# Altium schematic sheet FPGA_52_Ethernet_Send_Frame_E_MAC_W.SchDoc
size B; Organization: Altium Limited; Address1: L3, 12a Rodborough Rd; Address2: Frenchs Forest; Address3: NSW; Address4: Australia 2086; DocumentNumber: 1; SheetNumber: 1; SheetTotal: 1
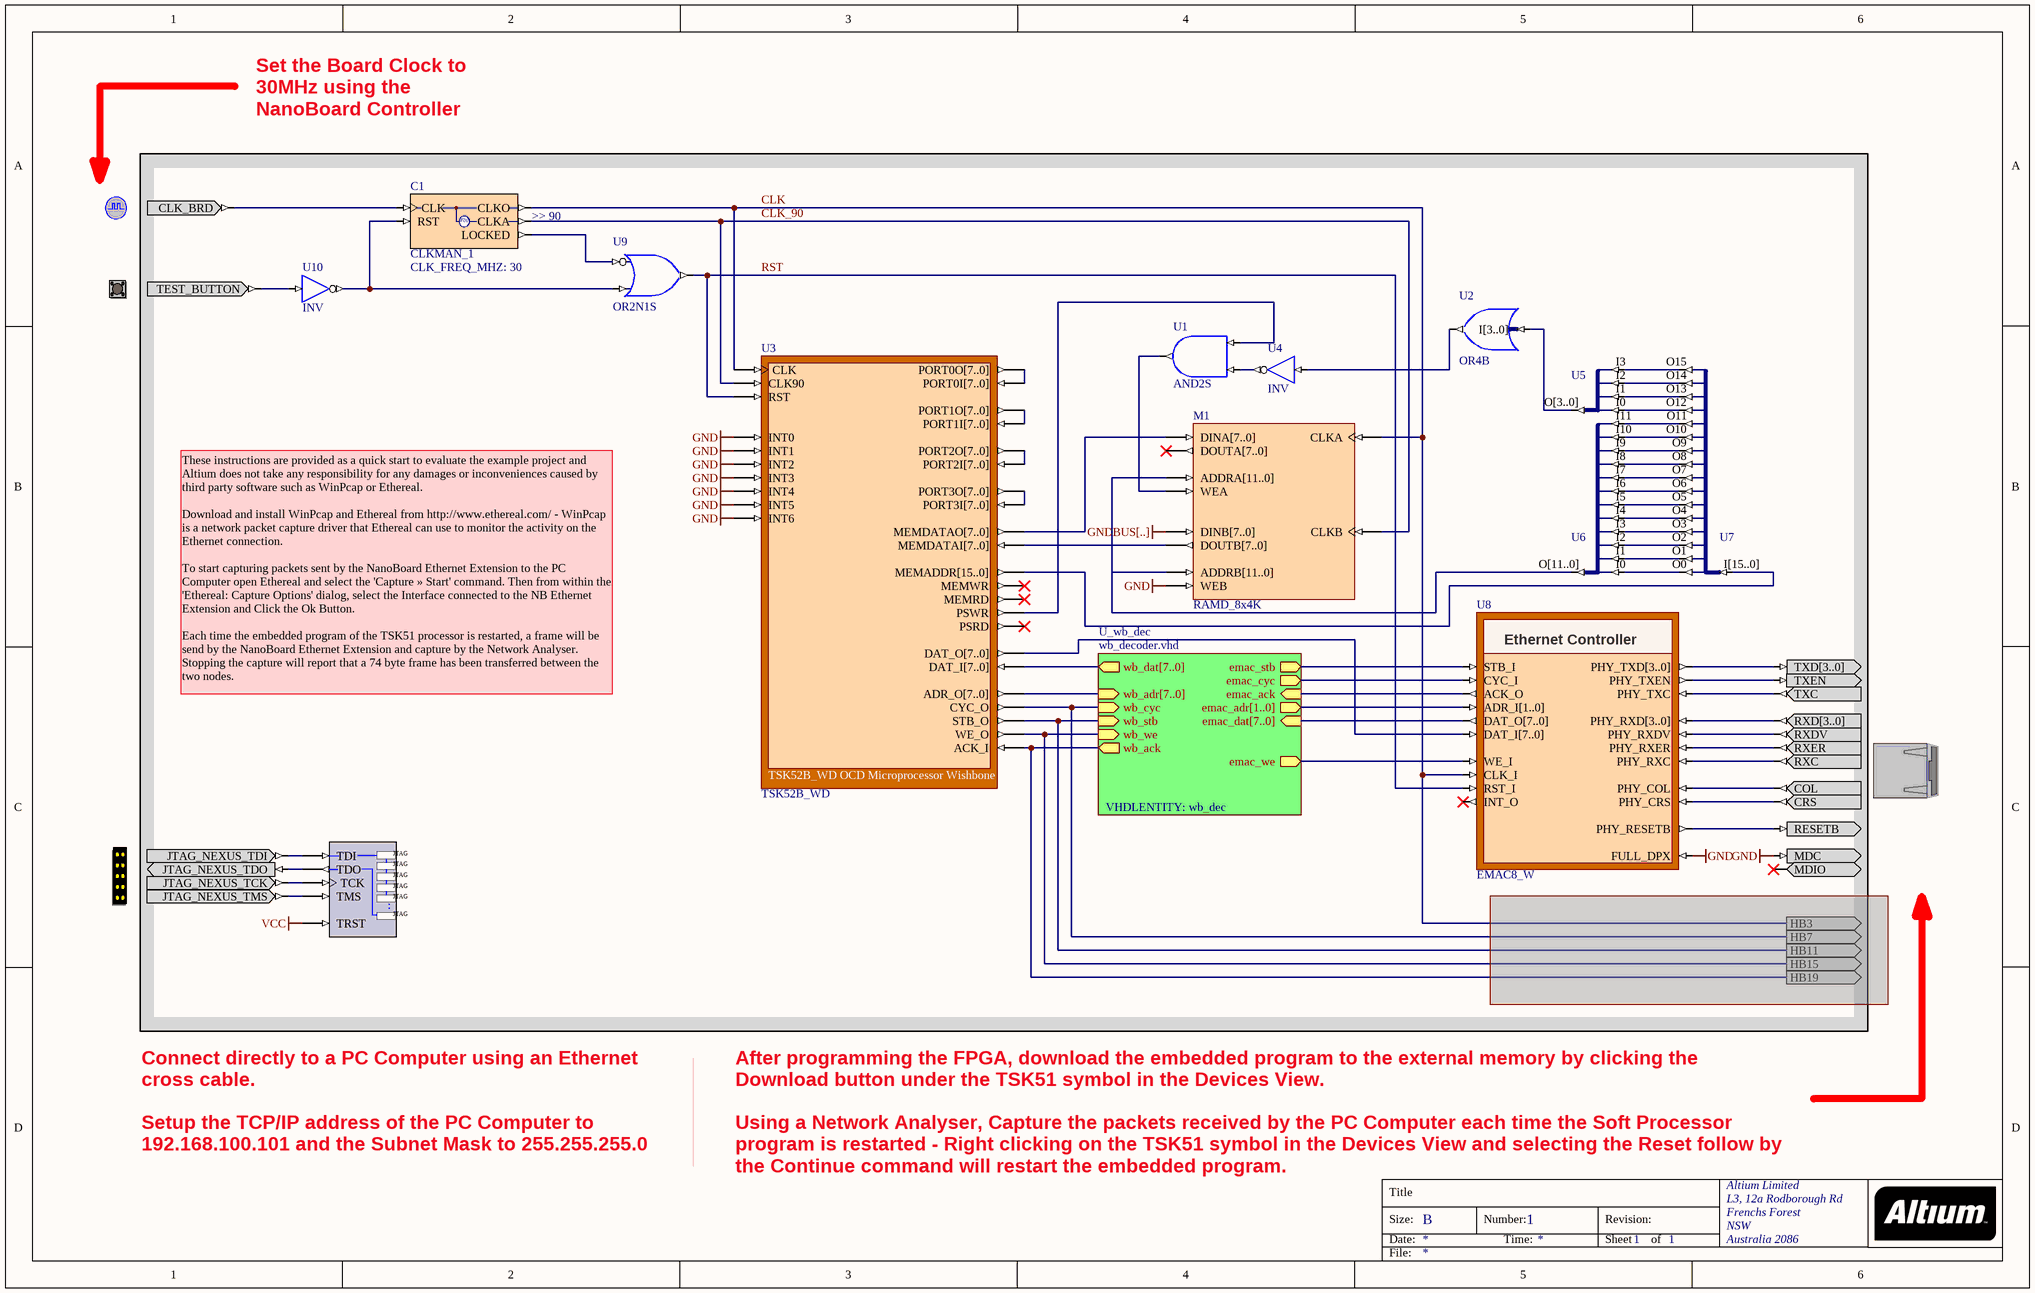
[diagram p0: FPGA_52_Ethernet_Send_Frame_E_MAC_W.SchDoc]

## Parts
(Parts that share a designator on the sheet are numbered #1, #2 ... from top to bottom, then left to right.)
?#1  CLOCK_BOARD  (value not drawn)
?#2  TEST_BUTTON  (value not drawn)
?#3  ETH_PHY  (value not drawn)
?#4  NEXUS_JTAG_CONNECTOR  (value not drawn)
C1  CLKMAN_1  CLK_FREQ_MHZ: 30  ClkA_Operation: >> 90
M1  RAMD_8x4K
NEXUS_JTAG_PORT  NEXUS_JTAG_PORT  (value not drawn)
U1  AND2S
U2  OR4B
U3  TSK52B_WD
U4  INV
U5  J4S_4B  (value not drawn)
U6  J12S_12B  (value not drawn)
U7  J16B_16S  (value not drawn)
U8  EMAC8_W
U9  OR2N1S
U10  INV

## Sub-sheets
U_wb_dec = wb_decoder.vhd: emac_ack (in), emac_adr[1..0] (out), emac_cyc (out), emac_dat[7..0] (in), emac_stb (out), emac_we (out), wb_ack (out), wb_adr[7..0] (in), wb_cyc (in), wb_dat[7..0] (out), wb_stb (in), wb_we (in)  | VHDLENTITY: wb_dec

## Ports
HB3 (out), HB7 (out), HB11 (out), HB15 (out), HB19 (out)

## Nets
GND: ?#3.MDC M1.WEB U3.INT0 U3.INT1 U3.INT2 U3.INT3 U3.INT4 U3.INT5 U3.INT6 U8.FULL_DPX
GNDBUS[..]: M1.DINB[7..0]
VCC: NEXUS_JTAG_PORT.TRST
CLK: C1.CLKO M1.CLKA U3.CLK U8.CLK_I
CLK_90: C1.CLKA M1.CLKB U3.CLK90
RST: U3.RST U8.RST_I U9.O
Net?#1_CLK_BRD: ?#1.CLK_BRD C1.CLK
Net?#2_TEST_BUTTON: ?#2.TEST_BUTTON U10.I
Net?#3_COL: ?#3.COL U8.PHY_COL
Net?#3_CRS: ?#3.CRS U8.PHY_CRS
Net?#3_RESETB: ?#3.RESETB U8.PHY_RESETB
Net?#3_RXC: ?#3.RXC U8.PHY_RXC
Net?#3_RXD[3..0]: ?#3.RXD[3..0] U8.PHY_RXD[3..0]
Net?#3_RXDV: ?#3.RXDV U8.PHY_RXDV
Net?#3_RXER: ?#3.RXER U8.PHY_RXER
Net?#3_TXC: ?#3.TXC U8.PHY_TXC
Net?#3_TXD[3..0]: ?#3.TXD[3..0] U8.PHY_TXD[3..0]
Net?#3_TXEN: ?#3.TXEN U8.PHY_TXEN
Net?#4_JTAG_NEXUS_TCK: ?#4.JTAG_NEXUS_TCK NEXUS_JTAG_PORT.TCK
Net?#4_JTAG_NEXUS_TDI: ?#4.JTAG_NEXUS_TDI NEXUS_JTAG_PORT.TDI
Net?#4_JTAG_NEXUS_TDO: ?#4.JTAG_NEXUS_TDO NEXUS_JTAG_PORT.TDO
Net?#4_JTAG_NEXUS_TMS: ?#4.JTAG_NEXUS_TMS NEXUS_JTAG_PORT.TMS
NetC1_LOCKED: C1.LOCKED U9.I0
NetC1_RST: C1.RST U9.I1 U10.O
NetM1_ADDRA[11..0]: M1.ADDRA[11..0] M1.ADDRB[11..0] U6.O[11..0]
NetM1_DINA[7..0]: M1.DINA[7..0] U3.MEMDATAO[7..0]
NetM1_DOUTB[7..0]: M1.DOUTB[7..0] U3.MEMDATAI[7..0]
NetM1_WEA: M1.WEA U1.O
NetU1_I0: U1.I0 U3.PSWR
NetU1_I1: U1.I1 U4.O
NetU2_I[3..0]: U2.I[3..0] U5.O[3..0]
NetU2_O: U2.O U4.I
NetU3_ACK_I: U3.ACK_I ; sheet U_wb_dec/wb_ack
NetU3_ADR_O[7..0]: U3.ADR_O[7..0] ; sheet U_wb_dec/wb_adr[7..0]
NetU3_CYC_O: U3.CYC_O ; sheet U_wb_dec/wb_cyc
NetU3_DAT_I[7..0]: U3.DAT_I[7..0] ; sheet U_wb_dec/wb_dat[7..0]
NetU3_DAT_O[7..0]: U3.DAT_O[7..0] U8.DAT_I[7..0]
NetU3_MEMADDR[15..0]: U3.MEMADDR[15..0] U7.I[15..0]
NetU3_PORT0I[7..0]: U3.PORT0I[7..0] U3.PORT0O[7..0]
NetU3_PORT1I[7..0]: U3.PORT1I[7..0] U3.PORT1O[7..0]
NetU3_PORT2I[7..0]: U3.PORT2I[7..0] U3.PORT2O[7..0]
NetU3_PORT3I[7..0]: U3.PORT3I[7..0] U3.PORT3O[7..0]
NetU3_STB_O: U3.STB_O ; sheet U_wb_dec/wb_stb
NetU3_WE_O: U3.WE_O ; sheet U_wb_dec/wb_we
NetU5_I0: U5.I0 U7.O12
NetU5_I1: U5.I1 U7.O13
NetU5_I2: U5.I2 U7.O14
NetU5_I3: U5.I3 U7.O15
NetU6_I0: U6.I0 U7.O0
NetU6_I1: U6.I1 U7.O1
NetU6_I2: U6.I2 U7.O2
NetU6_I3: U6.I3 U7.O3
NetU6_I4: U6.I4 U7.O4
NetU6_I5: U6.I5 U7.O5
NetU6_I6: U6.I6 U7.O6
NetU6_I7: U6.I7 U7.O7
NetU6_I8: U6.I8 U7.O8
NetU6_I9: U6.I9 U7.O9
NetU6_I10: U6.I10 U7.O10
NetU6_I11: U6.I11 U7.O11
NetU8_ACK_O: U8.ACK_O ; sheet U_wb_dec/emac_ack
NetU8_ADR_I[1..0]: U8.ADR_I[1..0] ; sheet U_wb_dec/emac_adr[1..0]
NetU8_CYC_I: U8.CYC_I ; sheet U_wb_dec/emac_cyc
NetU8_DAT_O[7..0]: U8.DAT_O[7..0] ; sheet U_wb_dec/emac_dat[7..0]
NetU8_STB_I: U8.STB_I ; sheet U_wb_dec/emac_stb
NetU8_WE_I: U8.WE_I ; sheet U_wb_dec/emac_we

Not connected (* = marked no-connect by the designer): ?#3 MDIO*; M1 DOUTA[7..0]*; U3 MEMRD* MEMWR* PSRD*; U8 INT_O*

## Notes on the sheet
- Set the Board Clock to 30MHz using the NanoBoard Controller
- These instructions are provided as a quick start to evaluate the example project and Altium does not take any responsibility for any damages or inconveniences caused by third party software such as WinPcap or Ethereal.
  Download and install WinPcap and Ethereal from http://www.ethereal.com/ - WinPcap is a network packet capture driver that Ethereal can use to monitor the activity on the Ethernet connection.
  To start capturing packets sent by the NanoBoard Ethernet Extension to the PC Computer open Ethereal and select the 'Capture » Start' command. Then from within the 'Ethereal: Capture Options' dialog, select the Interface connected to the NB Ethernet Extension and Click the Ok Button.
  Each time the embedded program of the TSK51 processor is restarted, a frame will be send by the NanoBoard Ethernet Extension and capture by the Network Analyser. Stopping the capture will report that a 74 byte frame has been transferred between the two nodes.
- Connect directly to a PC Computer using an Ethernet cross cable.
  Setup the TCP/IP address of the PC Computer to 192.168.100.101 and the Subnet Mask to 255.255.255.0
- After programming the FPGA, download the embedded program to the external memory by clicking the Download button under the TSK51 symbol in the Devices View.
  Using a Network Analyser, Capture the packets received by the PC Computer each time the Soft Processor program is restarted - Right clicking on the TSK51 symbol in the Devices View and selecting the Reset follow by the Continue command will restart the embedded program.
- Title
- Size:
- Date:
- B
- Number:
- Time:
- Revision:
- Sheet
- of
- File:
- (in symbol CLKMAN_1) F(x)
- (in symbol EMAC8_W) Ethernet Controller
- (in symbol NEXUS_JTAG_PORT) .

## Library data of the parts
?#1 = CLOCK_BOARD: Global System Clock Supply; PortComponent: True; Published: 19-Nov-2003; Publisher: Altium Limited
?#2 = TEST_BUTTON: Test Button; PortComponent: True; Published: 19-Nov-2003; Publisher: Altium Limited
?#3 = ETH_PHY: Ethernet PHY-interface; PortComponent: True; Published: 19-Nov-2003; Publisher: Altium Limited
?#4 = NEXUS_JTAG_CONNECTOR: JTAG Port; PortComponent: True; Published: 19-Nov-2003; Publisher: Altium Limited
C1 = CLKMAN_1: Single Operational Output Clock Manager; Clk_Count: 1; Published: 5-Jul-2004; Publisher: Altium Limited; Core Revision: 1.00.00; Nexus_Core: ClockManager; HelpURL: CR0118 FPGA Generic Library Guide.pdf#page=148; Functional Class: Clock Manager; Port Size: 1
M1 = RAMD_8x4K: Dual Port Random Access Memory; Memory_DepthA: 4096; Memory_Type: RAM_DualPortBlock; Memory_WidthA: 8; Memory_ClockEdge: Rising; Nexus_Core: Memory_Program; Published: 13/01/2004; Publisher: Altium Hobart Technology Center; Memory_DepthB: 4096; Memory_WidthB: 8
NEXUS_JTAG_PORT = NEXUS_JTAG_PORT: Soft Nexus-Chain Connector; NEXUS_JTAG_CONNECTOR: True; FunctionalClass: JTAG; Published: 29-Jan-2004; Publisher: Altium Limited; LastRevisionNo: 1.00.00; HelpURL: CR0118 FPGA Generic Library Guide.pdf#page=399
U1 = AND2S: 2-Input AND Gate, Single Pin Version; Xilinx Equivalent: AND2; ArchiveName: GENERIC; VHDLIB_SIM: GENERIC_LIB; Published: 29-Jan-2004; Publisher: Altium Limited; Core Revision: 1.00.00
U2 = OR4B: 4-Input OR Gate, Bus Version; ArchiveName: GENERIC; VHDLIB_SIM: GENERIC_LIB; Published: 29-Jan-2004; Publisher: Altium Limited; Core Revision: 1.00.00
U3 = TSK52B_WD: TSK52B_WD OCD Microprocessor Wishbone; NEXUS_CORE: Processor_OCDS; NEXUS_JTAG_DEVICE: True; NEXUS_JTAG_ORDER: 0; ChildModel1: TSK52B_WD_DRAM8X256; ChildCore1: M1; Published: 9/08/2004; Publisher: Altium Hobart Technology Centre; Core Revision: 1.00.00
U4 U10 = INV: Inverter; ArchiveName: GENERIC; VHDLIB_SIM: GENERIC_LIB; Published: 29-Jan-2004; Publisher: Altium Limited; Xilinx Equivalent: INV; Core Revision: 1.00.00
U5 = J4S_4B: 4 Single pin inputs to single 4-Bit output bus; Functional Class: Bus Joiner; Port Size: 4; ArchiveName: GENERIC; VHDLIB_SIM: GENERIC_LIB; Published: 29-Jan-2004; Publisher: Altium Limited; Core Revision: 1.00.00; HelpURL: CR0118 FPGA Generic Library Guide.pdf#page=305
U6 = J12S_12B: 12 Single pin inputs to single 12-Bit output bus; Functional Class: Bus Joiner; Port Size: 12; ArchiveName: GENERIC; VHDLIB_SIM: GENERIC_LIB; Published: 29-Jan-2004; Publisher: Altium Limited; Core Revision: 1.00.00; HelpURL: CR0118 FPGA Generic Library Guide.pdf#page=305
U7 = J16B_16S: Single 16-Bit input bus to 16 single pin outputs; Functional Class: Bus Joiner; Port Size: 16; ArchiveName: GENERIC; VHDLIB_SIM: GENERIC_LIB; Published: 29-Jan-2004; Publisher: Altium Limited; Core Revision: 1.00.00; HelpURL: CR0118 FPGA Generic Library Guide.pdf#page=303
U8 = EMAC8_W: Ethernet Controller Wishbone; ChildModel1: Memory_M1_EMAC; ChildModel2: Memory_M2_EMAC; ChildModel3: Memory_M1_EMAC_prim0; ChildModel4: Memory_M2_EMAC_prim0; UseInDSF: True; Publisher: Altium Limited; Published: 11-May-2005; ComponentLink1Description: Core &Resource Usage; ComponentLink1URL: CR0139 FPGA Peripheral Resource Usage.pdf#page=9; HelpURL: CR0122 EMACx Controller.pdf; LastRevisionNo: 1.00.00
U9 = OR2N1S: 2-Input OR Gate with Active Low A Input, Single Pin Version; Xilinx Equivalent: OR2B1; ArchiveName: GENERIC; VHDLIB_SIM: GENERIC_LIB; Published: 29-Jan-2004; Publisher: Altium Limited; Core Revision: 1.00.00